# EAGLE design BatchE (EAGLE 6.4)

## Sheet 1 of 3
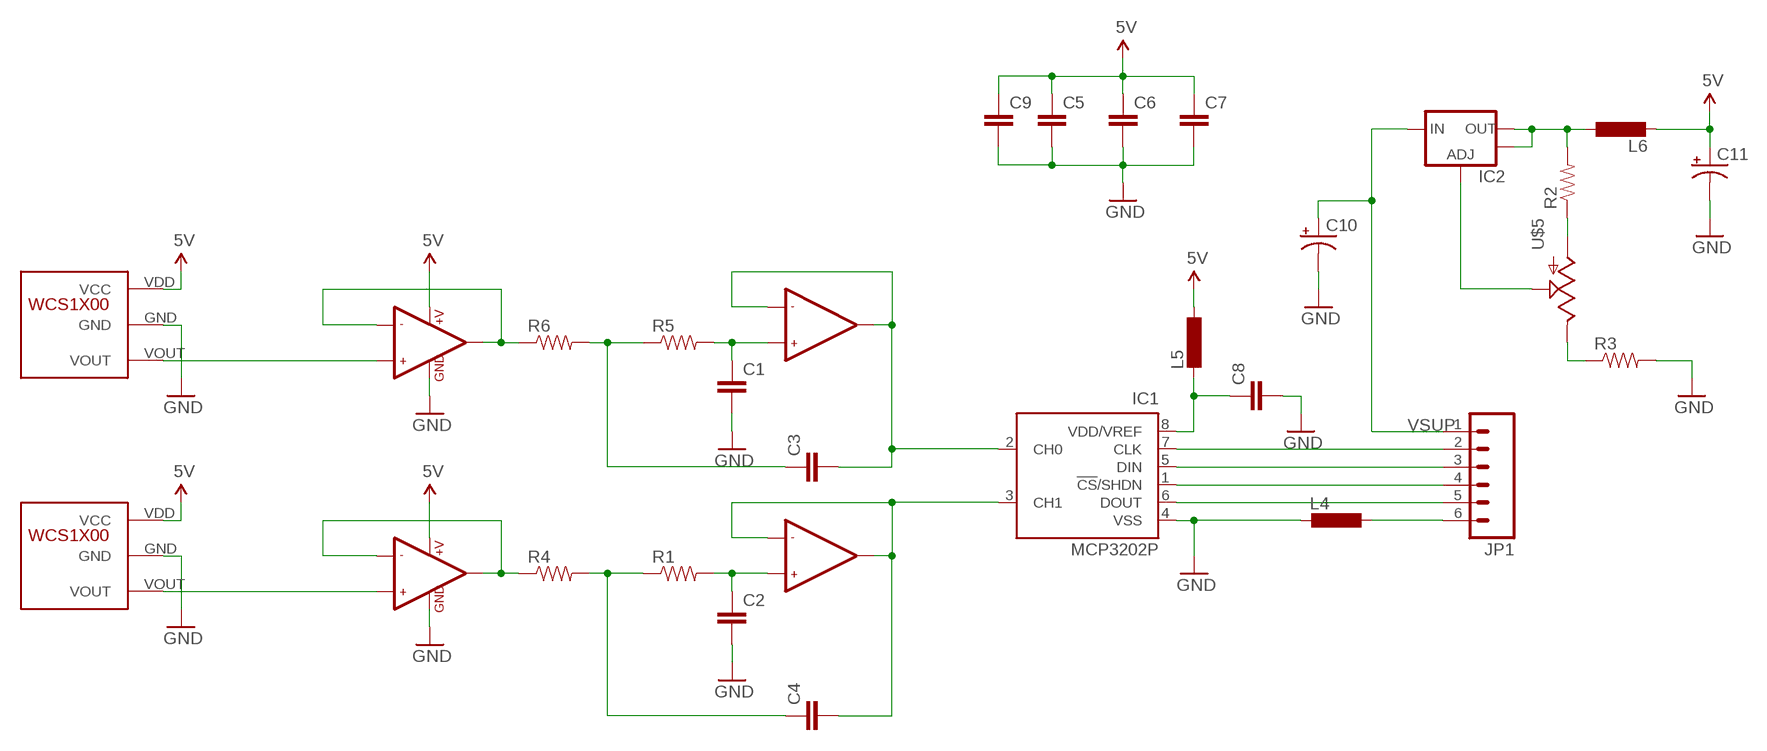
[diagram p0: schematic, sheet 1]

### Parts
C1  CAP1206  [1206]
C2  CAP1206  [1206]
C3  CAP1206  [1206]
C4  CAP1206  [1206]
C5  CAP1206  [1206]
C6  CAP1206  [1206]
C7  CAP1206  [1206]
C8  CAP1206  [1206]
C9  CAP1206  [1206]
C10  CAP_POLPTH4  [CPOL-RADIAL-1000UF-25V]
C11  CAP_POLPTH1  [CPOL-RADIAL-100UF-25V]
IC1  MCP3202P  [DIL8]
IC2  V_REG_LM1117SOT223  [SOT223]
JP1  M06LONGPADS  [1X06_LONGPADS]
L4  L-EU0204V  [0204V]
L5  L-EU0204V  [0204V]
L6  L-EU0204V  [0204V]
R1  RESISTOR1206  [1206]
R2  RESISTOR1206  [1206]
R3  RESISTOR1206  [1206]
R4  RESISTOR1206  [1206]
R5  RESISTOR1206  [1206]
R6  RESISTOR1206  [1206]
U$1  LMV358  [SO08]
U$2  LMV358  [SO08]
U$3  WCS1X00  [WCS1X00]
U$4  WCS1X00  [WCS1X00]
U$5  POTTRIM  [TRIM_POT]

### Nets
5V: C5.1 C6.1 C7.1 C9.1 C11.1(+) L5.1 L6.2 U$1.8(+V) U$2.8(+V) U$3.VDD(VCC) U$4.VDD(VCC)
GND: C1.2 C2.2 C5.2 C6.2 C7.2 C8.2 C9.2 C10.2(-) C11.2(-) IC1.4(VSS) L4.2 R3.2 U$1.4(GND) U$2.4(GND) U$3.GND U$4.GND ; also sheet 3
N$1: R6.1 U$1.1(OUT1) U$1.2(-IN1)
N$2: R4.1 U$2.1(OUT1) U$2.2(-IN1)
N$3: C3.1 R5.1 R6.2
N$4: C1.1 R5.2 U$1.5(+IN2)
N$5: C3.2 IC1.2(CH0) U$1.6(-IN2) U$1.7(OUT2)
N$6: U$1.3(+IN1) U$3.VOUT
N$7: C4.2 IC1.3(CH1) U$2.6(-IN2) U$2.7(OUT2)
N$8: C2.1 R1.2 U$2.5(+IN2)
N$9: C4.1 R1.1 R4.2
N$10: U$2.3(+IN1) U$4.VOUT
N$11: R2.1 U$5.3(A)
N$12: IC2.1(ADJ) U$5.1(S)
N$13: IC1.7(CLK) JP1.2
N$14: IC1.5(DIN) JP1.3
N$15: IC1.1(!CS!/SHDN) JP1.4
N$16: IC1.6(DOUT) JP1.5
N$17: IC2.2(OUT) IC2.4(OUT) L6.1 R2.2
N$18: R3.1 U$5.2(E)
N$19: JP1.6 L4.1
N$20: C8.1 IC1.8(VDD/VREF) L5.2
VSUP: C10.1(+) IC2.3(IN) JP1.1

## Sheet 2 of 3
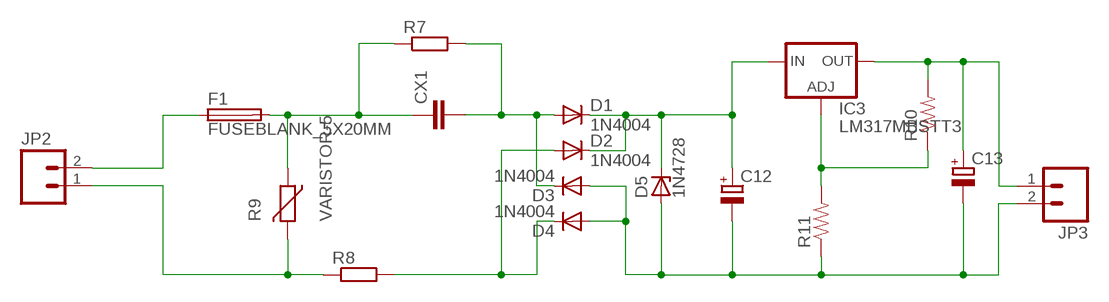
[diagram p1: schematic, sheet 2]

### Parts
C12  CPOL-EUE5-8.5  [E5-8,5]
C13  CPOL-EUE5-8.5  [E5-8,5]
CX1  CXXC15B8  [XC15B8]
D1  1N4004  [DO41-10]
D2  1N4004  [DO41-10]
D3  1N4004  [DO41-10]
D4  1N4004  [DO41-10]
D5  1N4728  [DO41Z10]
F1  FUSEBLANK_5X20MM  [FUSE_HOLDER_5X20MM]
IC3  LM317MBSTT3  [SOT223]
JP2  M023.5MM  [SCREWTERMINAL-3.5MM-2]
JP3  M023.5MM  [SCREWTERMINAL-3.5MM-2]
R7  R-EU_0207/12  [0207/12]
R8  R-EU_0207/12  [0207/12]
R9  VARISTOR-5  [R-5]
R10  RESISTOR0805-RES  [0805]
R11  RESISTOR0805-RES  [0805]

### Nets
N$21: F1.1 JP2.2
N$22: CX1.1 F1.2 R7.1 R9.1
N$23: CX1.2 D1.A D3.C R7.2
N$24: D2.A D4.C R8.2
N$25: JP2.1 R8.1 R9.2
N$26: C12.+ D1.C D2.C D5.C IC3.3(IN)
N$27: IC3.1(ADJ) R10.1 R11.2
N$28: C12.- C13.- D3.A D4.A D5.A JP3.2 R11.1
N$30: C13.+ IC3.4(OUT) JP3.1 R10.2

## Sheet 3 of 3
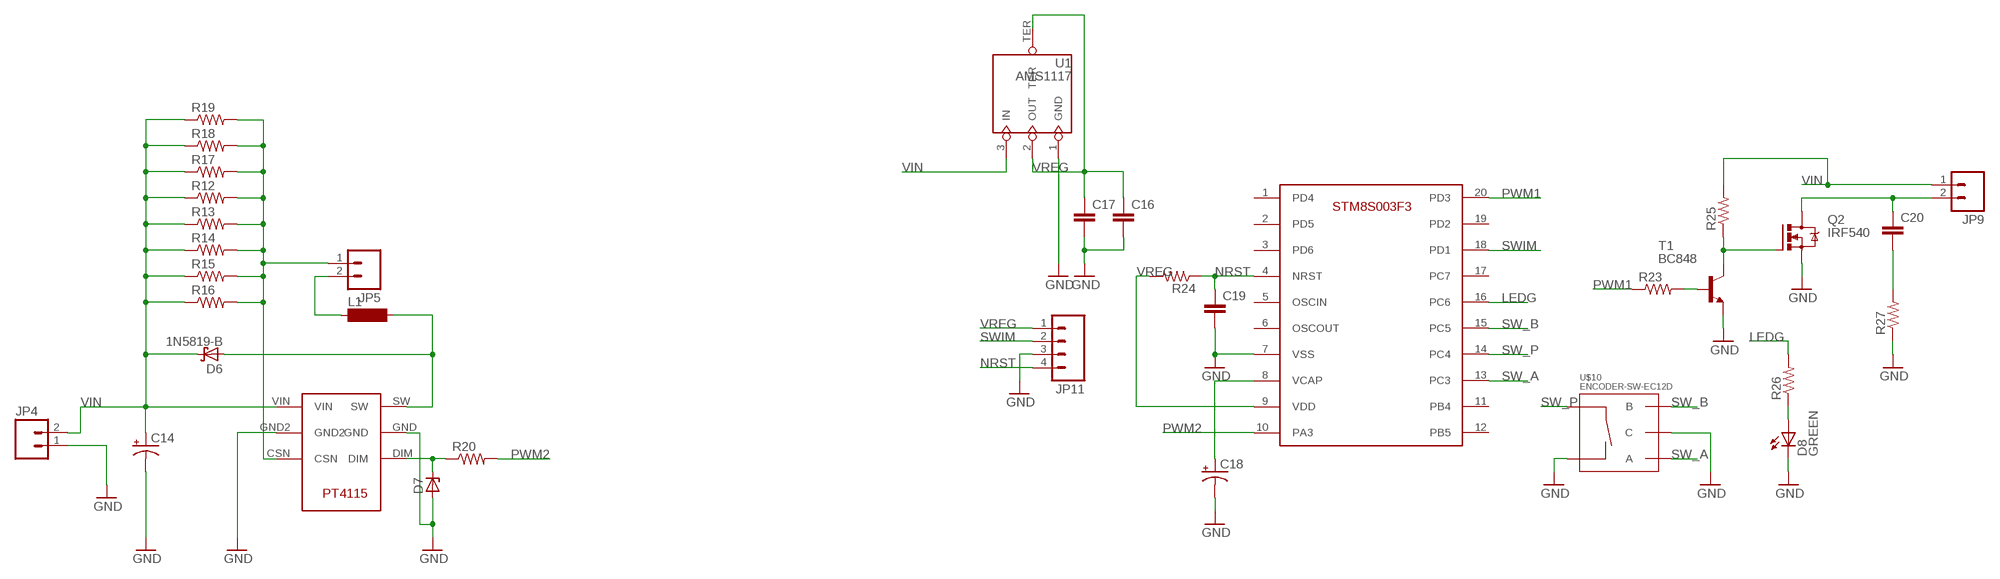
[diagram p2: schematic, sheet 3]

### Parts
C14  CAP_POLPTH4  [CPOL-RADIAL-1000UF-25V]
C16  CAP1206  [1206]
C17  CAP1206  [1206]
C18  CAP_POLPTH2  [CPOL-RADIAL-10UF-25V]
C19  CAP1206  [1206]
C20  CAP1206  [1206]
D6  1N5819-B  [DO41-7.6]
D7  ZENER-DIODEZD-7.5  [ZDIO-7.5]
D8  GREEN  LED-GREENLARGE  [LED-1206]
JP4  M02LOCK_LONGPADS  [1X02_LOCK_LONGPADS]
JP5  M02LOCK_LONGPADS  [1X02_LOCK_LONGPADS]
JP9  M02LOCK_LONGPADS  [1X02_LOCK_LONGPADS]
JP11  M04PTH  [1X04]
L1  BS11  [BS11]
Q2  IRF540  [TO220BV]
R12  RESISTOR1206  [1206]
R13  RESISTOR1206  [1206]
R14  RESISTOR1206  [1206]
R15  RESISTOR1206  [1206]
R16  RESISTOR1206  [1206]
R17  RESISTOR1206  [1206]
R18  RESISTOR1206  [1206]
R19  RESISTOR1206  [1206]
R20  RESISTOR1206  [1206]
R23  RESISTOR0805-RES  [0805]
R24  RESISTOR0805-RES  [0805]
R25  RESISTOR0805-RES  [0805]
R26  RESISTOR0805-RES  [0805]
R27  RESISTOR0805-RES  [0805]
T1  BC848  [SOT23]
U1  AMS1117  [SOT-223]
U$6  PT4115  [PT4115]
U$9  STM8S003F3  [SSOP20]
U$10  ENCODER-SW-EC12D  [ENCODER-SW-EC12D]

### Nets
GND: C14.2(-) C16.2 C17.2 C18.2(-) C19.2 D7.A D8.C JP4.1 JP11.3 Q2.S R27.1 T1.2(E) U1.1(GND) U$6.GND U$6.GND2 U$9.7(VSS) U$10.4(C) U$10.5(SW-) ; also sheet 1
LEDG: R26.2 U$9.16(PC6)
N$29: JP5.1 R12.2 R13.2 R14.2 R15.2 R16.2 R17.2 R18.2 R19.2 U$6.CSN
N$31: D8.A R26.1
N$33: Q2.G R25.1 T1.3(C)
N$35: D7.C R20.1 U$6.DIM
N$36: C20.2 R27.2
N$37: D6.A L1.2 U$6.SW
N$38: JP5.2 L1.1
N$42: C20.1 JP9.2 Q2.D
N$43: C18.1(+) U$9.8(VCAP)
N$44: R23.2 T1.1(B)
NRST: C19.1 JP11.4 R24.1 U$9.4(NRST)
PWM1: R23.1 U$9.20(PD3)
PWM2: R20.2 U$9.10(PA3)
SW_A: U$9.13(PC3) U$10.1(A)
SW_B: U$9.15(PC5) U$10.3(B)
SW_P: U$9.14(PC4) U$10.2(SW+)
SWIM: JP11.2 U$9.18(PD1)
VIN: C14.1(+) D6.C JP4.2 JP9.1 R12.1 R13.1 R14.1 R15.1 R16.1 R17.1 R18.1 R19.1 R25.2 U1.3(IN) U$6.VIN
VREG: C16.1 C17.1 JP11.1 R24.2 U1.2(OUT) U1.TER U$9.9(VDD)
Unconnected: U$9.1(PD4) U$9.2(PD5) U$9.3(PD6) U$9.5(OSCIN) U$9.6(OSCOUT) U$9.11(PB4) U$9.12(PB5) U$9.17(PC7) U$9.19(PD2)

## Library data of the parts
C1-C9 C16 C17 C19 C20 = SparkFun-Capacitors:CAP: Capacitor Standard 0603 ceramic capacitor, and 0.1" leaded capacitor.
C10 C11 C14 C18 = SparkFun-Capacitors:CAP_POL: Capacitor Polarized These are standard SMD and PTH capacitors. Normally 10uF, 47uF, and 100uF in electrolytic and tantalum varieties. Always verify the external diameter of the through hole cap, it varies with capacity, voltage, and manufacturer. The EIA devices should be standard.
C12 C13 = rcl:CPOL-EU: POLARIZED CAPACITOR, European symbol
CX1 = resistor:CX: X CAPACITOR for power line
D1-D4 = diode:1N4004: DIODE general purpose rectifier, 1 A
D5 = diode:1N4728: Z DIODE 3.3 V, 1W, 5 percent
D6 = diode:1N581*: 1.0A SCHOTTKY BARRIER RECTIFIER Source: http://www.diodes.com/datasheets/ds23001.pdf
D7 = diode:ZENER-DIODE: Z-Diode
D8 = SparkFun-LED:LED-GREEN: Various green LEDs 0603- DIO-00821 LARGE- DIO-00862 LILYPAD- DIO-09910; PROD_ID: DIO-00862
F1 = fuse:FUSE: Fuse; OC_FARNELL: unknown; OC_NEWARK: unknown
IC1 = microchip:MCP3202: 2.7V Dual Channel 12-Bit A/D Converter with SPI Serial Interface Source: http://ww1.microchip.com/downloads/en/DeviceDoc/21034D.pdf; MF: MICROCHIP; MPN: MCP3202-CI/P; OC_FARNELL: 1196794; OC_NEWARK: 72K7287
IC2 = SparkFun-PowerIC:V_REG_LM1117: Voltage Regulator LM1117 Standard adjustable voltage regulator but in SMD form. Spark Fun Electronics SKU : COM-00595
IC3 = v-reg:LM317?*: 500 mA Adjustable Output Positive Voltage Regulator Source: http://www.onsemi.co.jp .. LM317M-D.PDF
JP1 = SparkFun-Connectors:M06: Header 6 Standard 6-pin 0.1" header. Use with straight break away headers (SKU : PRT-00116), right angle break away headers (PRT-00553), swiss pins (PRT-00743), machine pins (PRT-00117), and female headers (PRT-00115). Molex polarized connector foot print use with SKU : PRT-08094 with associated crimp pins and housings. NOTES ON THE VARIANTS LOCK and LOCK_LONGPADS... This footprint was designed to help hold the alignment of a through-hole component (i.e. 6-pin header) while soldering it into place. You may notice that each hole has been shifted either up or down by 0.005 of an inch from it's more standard position (which is a perfectly straight line). This slight alteration caused the pins (the squares in the middle) to touch the edges of the holes. Because they are alternating, it causes a "brace" to hold the component in place. 0.005 has proven to be the perfect amount of "off-center" position when using our standard breakaway headers. Although looks a little odd when you look at the bare footprint, once you have a header in there, the alteration is very hard to notice. Also, if you push a header all the way into place, it is covered up entirely on the bottom side. This idea of altering the position of holes to aid alignment will be further integrated into the Sparkfun Library for other footprints. It can help hold any component with 3 or more connection pins.
JP2-JP5 JP9 = SparkFun-Connectors:M02: Header 2 Standard 2-pin 0.1" header. Use with straight break away headers (SKU : PRT-00116), right angle break away headers (PRT-00553), swiss pins (PRT-00743), machine pins (PRT-00117), and female headers (PRT-00115). Molex polarized connector foot print use with SKU : PRT-08233 with associated crimp pins and housings.
JP11 = SparkFun-Connectors:M04: Header 4 Standard 4-pin 0.1" header. Use with straight break away headers (SKU : PRT-00116), right angle break away headers (PRT-00553), swiss pins (PRT-00743), machine pins (PRT-00117), and female headers (PRT-00115). Molex polarized connector foot print use with SKU : PRT-08231 with associated crimp pins and housings. 1MM SMD Version SKU: PRT-10208
L1 = inductor-neosid:BS: INDUCTOR nominal inductance, magnetically screened; OC_FARNELL: unknown; OC_NEWARK: unknown
L4-L6 = rcl:L-EU: INDUCTOR, European symbol
Q2 = transistor-power:IRF540: HEXFET Power MOSFET
R1-R6 R23-R27 = SparkFun-Passives:RESISTOR: Resistor Basic schematic elements and footprints for 0603, 1206, and PTH resistors.
R7 R8 = rcl:R-EU_: RESISTOR, European symbol
R9 = varistor:VARISTOR: VARISTOR
R10-R20 = SparkFun-Resistors:RESISTOR: Resistor Basic schematic elements and footprints for 0603, 1206, and PTH resistors.
T1 = transistor-neu-to92:BC848: NPN TRANSISTOR
U1 = IC:AMS1117
U$1 U$2 = SparkFun-AnalogIC:LMV358: Jellybean rail-to-rail output op-amp
U$3 U$4 = IC:WCS1X00
U$5 = SparkFun-Electromechanical:POT
U$6 = IC:PT4115
U$9 = SparkFun-DigitalIC:STM8S003F3
U$10 = SparkFun-Electromechanical:ENCODER-SW-EC12D

## Board
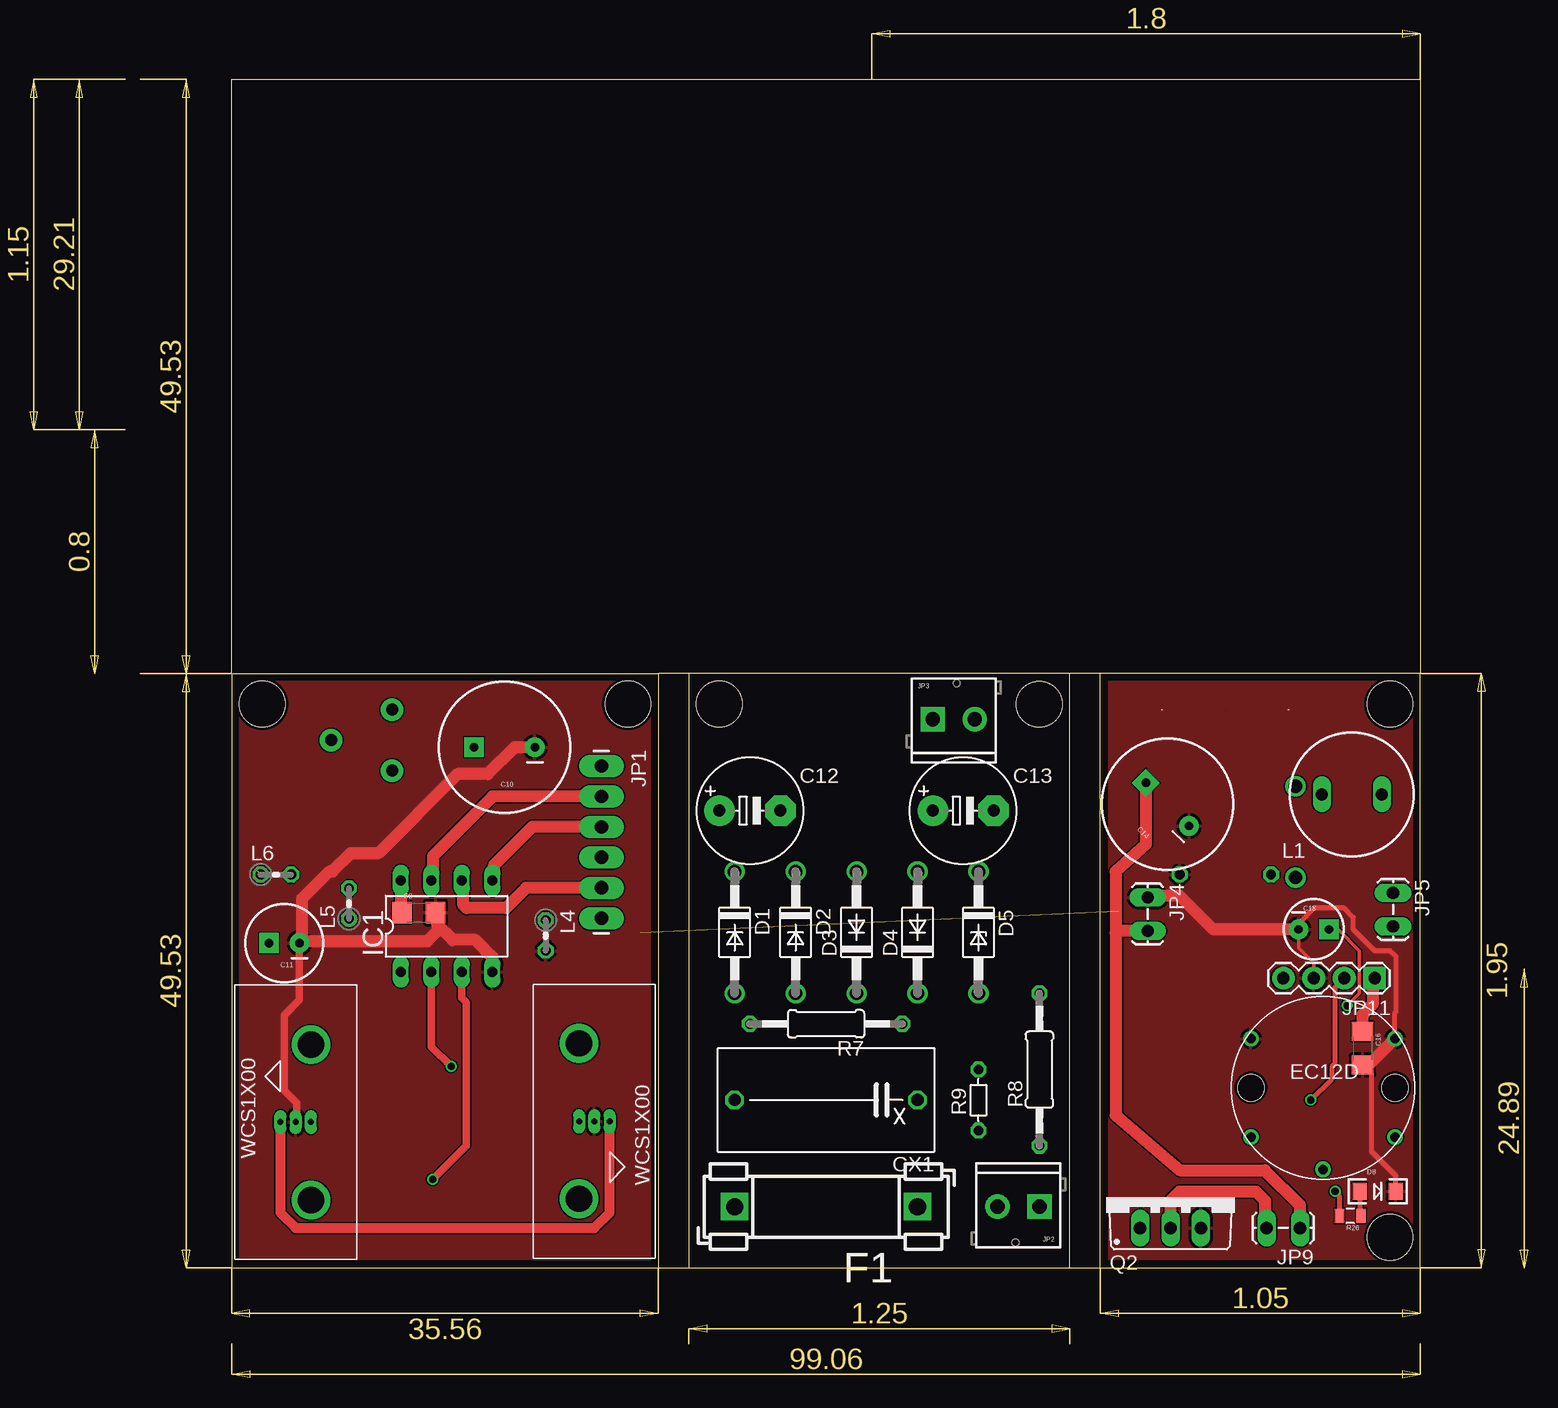
[diagram p3: board, top side]
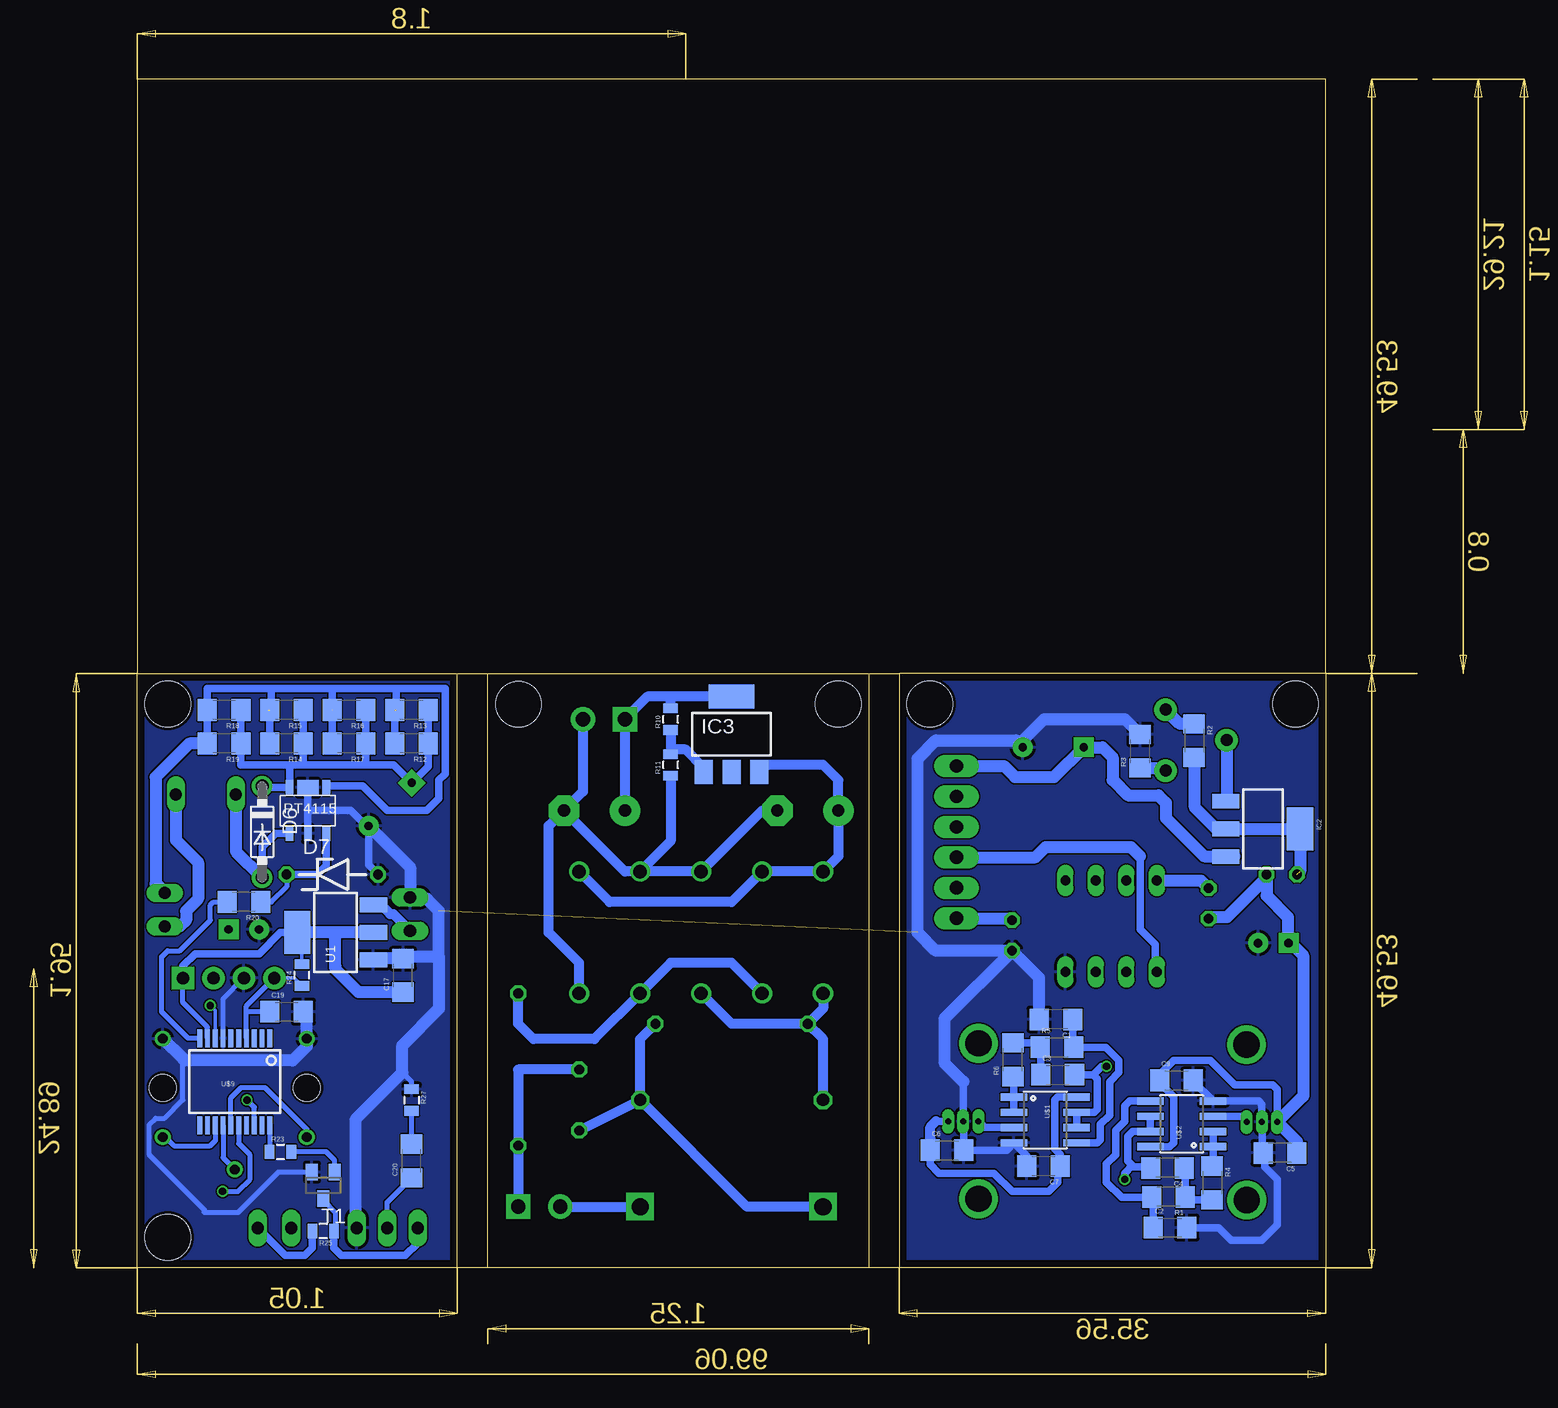
[diagram p4: board, bottom side, seen from below]

Size 99.06 x 99.06 mm. Coordinates in mm from the lower left corner, seen from the top.
Outline: 35.56,0 0,0 0,49.53
Outline: 35.56,0 38.1,0
Outline: 38.1,0 69.85,0
Outline: 69.85,0 72.39,0
Outline: 72.39,0 99.06,0 99.06,49.53
Outline: 99.06,49.53 72.39,49.53
Outline: 72.39,49.53 69.85,49.53
Outline: 69.85,49.53 38.1,49.53
Outline: 38.1,49.53 35.56,49.53
Outline: 35.56,49.53 35.56,0
Outline: 38.1,49.53 38.1,0
Outline: 0,49.53 35.56,49.53
Outline: 69.85,0 69.85,49.53
Outline: 72.39,0 72.39,49.53
Outline: 0,49.53 0,69.85 0,99.06 53.34,99.06 99.06,99.06 99.06,49.53
Copper layers (1*16): Top 0.035mm / dielectric 1.5mm / Bottom 0.035mm
Design rules "dirt_cheap_dirty_boards.v1": minimum track width 5mil, minimum drill 12mil, track to track 5mil, track to pad 5mil, pad to pad 5mil, via to via 5mil, smd to smd 0mil, copper to edge 10mil, drill to drill 10mil, minimum pad ring 10mil, minimum via ring 6mil, stop-mask expansion 2mil, vias tented up to drill 25mil, thermal gap 10mil
Holes 3.81 mm at 2.54,46.99 33.02,46.99 40.64,46.99 67.28,46.96 96.52,2.54 96.52,46.99

### Footprints (pad centres in the part's own frame; a part is rotated, then mirrored left to right if it is on the bottom)
1206 = smd 1.6 x 1.8: 1 -1.4,0; 2 1.4,0
CPOL-RADIAL-1000UF-25V = drill 0.7 pad 1.651 square: 1 2.54,0 | drill 0.7 pad 1.651: 2 -2.54,0
CPOL-RADIAL-100UF-25V = drill 0.7 pad 1.651 square: 1 1.27,0 | drill 0.7 pad 1.651: 2 -1.27,0
E5-8,5 = drill 1.016 pad 2.54: + -2.54,0 | drill 1.016 pad 2.54 octagon: - 2.54,0
CPOL-RADIAL-10UF-25V = drill 0.7 pad 1.651 square: 1 1.27,0 | drill 0.7 pad 1.651: 2 -1.27,0
XC15B8 = drill 1.016 octagon: 1 -7.62,0; 2 7.62,0
DO41-10 = drill 1.118: A 5.08,0; C -5.08,0
DO41Z10 = drill 1.118: A 5.08,0; C -5.08,0
DO41-7.6 = drill 1.1 pad 1.7: A 3.81,0; C -3.81,0
ZDIO-7.5 = drill 0.813 octagon: A 3.81,0; C -3.81,0
LED-1206 = smd 1.2 x 1.4: A -1.5,0; C 1.5,0
FUSE_HOLDER_5X20MM = drill 1.422 pad 2.286 square: 1 0,0; 2 15.24,0
DIL8 = drill 0.813 long: 1 -3.81,-3.81; 2 -1.27,-3.81; 3 1.27,-3.81; 4 3.81,-3.81; 5 3.81,3.81; 6 1.27,3.81; 7 -1.27,3.81; 8 -3.81,3.81
SOT223 = smd 1.219 x 2.235: 1 -2.311,-3.099; 2 0,-3.099; 3 2.311,-3.099 | smd 3.6 x 2.2: 4 0,3.099
SOT223' = smd 1.5 x 2: 1 -2.3,-3.15; 2 0,-3.15; 3 2.3,-3.15 | smd 3.8 x 2: 4 0,3.15
1X06_LONGPADS = drill 1.118 pad 1.88 long: 1 0,0; 2 2.54,0; 3 5.08,0; 4 7.62,0; 5 10.16,0; 6 12.7,0
SCREWTERMINAL-3.5MM-2 = drill 1.2 pad 2.032 square: 1 0,0 | drill 1.2 pad 2.032: 2 3.5,0
1X02_LOCK_LONGPADS = drill 1.016 long: 1 -0.127,0; 2 2.667,0
1X04 = drill 1.016 pad 1.88 square: 1 0,0 | drill 1.016 pad 1.88: 2 2.54,0; 3 5.08,0; 4 7.62,0
BS11 = drill 1 long: 1 -2.5,0; 2 2.5,0
0204V = drill 0.813 octagon: 1 -1.27,0; 2 1.27,0
TO220BV = drill 1.016 long: D 0,-2.54; G -2.54,-2.54; S 2.54,-2.54
0207/12 = drill 0.813 octagon: 1 -6.35,0; 2 6.35,0
R-5 = drill 0.813 octagon: 1 -2.54,0; 2 2.54,0
0805 = smd 0.8 x 1.2: 1 -0.9,0; 2 0.9,0
SOT23 = smd 1 x 1.4: 1 -0.95,-1.1; 2 0.95,-1.1; 3 0,1.1
SOT-223 = smd 1.27 x 2.286: 1 -2.286,-3.175; 2 0,-3.175; 3 2.286,-3.175 | smd 3.556 x 2.159: TER 0,3.175
SO08 = smd 0.61 x 2.21: 1 -1.905,-2.616; 2 -0.635,-2.616; 3 0.635,-2.616; 4 1.905,-2.616; 5 1.905,2.616; 6 0.635,2.616; 7 -0.635,2.616; 8 -1.905,2.616
WCS1X00 = drill 0.5 pad 0.813 long: GND 0,0; VDD -1.27,0; VOUT 1.27,0 | drill 2.2: P$4 1.285,6.46; P$5 1.27,-6.5
TRIM_POT = drill 1 pad 1.88: 1 5.08,0; 2 0,2.54; 3 0,-2.54
PT4115 = smd 0.635 x 1.27: CSN 1.524,1.905; DIM 1.524,-1.905; GND 0,-1.905; SW -1.524,-1.905; VIN -1.524,1.905 | smd 1.778 x 1.27: GND2 0,1.905
SSOP20 = smd 0.4 x 1.5: 1 -2.925,-3.625; 2 -2.275,-3.625; 3 -1.625,-3.625; 4 -0.975,-3.625; 5 -0.325,-3.625; 6 0.325,-3.625; 7 0.975,-3.625; 8 1.625,-3.625; 9 2.275,-3.625; 10 2.925,-3.625; 11 2.925,3.625; 12 2.275,3.625; 13 1.625,3.625; 14 0.975,3.625; 15 0.325,3.625; 16 -0.325,3.625; 17 -0.975,3.625; 18 -1.625,3.625; 19 -2.275,3.625; 20 -2.925,3.625
ENCODER-SW-EC12D = drill 0.8: 1 -6,4.1; 2 0,6.8; 3 6,4.1; 4 -6,-4.1; 5 6,-4.1 | hole 2.2: -6,0; 6,0

### Placement (x,y rotation side)
C1  22.5,20.68 180 bottom
C2  12.99,3.34 0 bottom
C3  22.36,16.08 0 bottom
C4  13.2,8.31 180 bottom
C5  3.83,9.55 180 bottom
C6  31.57,9.79 0 bottom
C7  23.53,8.45 180 bottom
C8  15.59,29.6 0 top
C9  12.46,15.61 0 bottom
C10  22.73,43.38 180 top
C11  4.38,27.06 180 top
C12  43.18,38.1 0 top
C13  60.96,38.1 0 top
C14  77.98,38.61 135 top
C16  94.23,18.29 270 top
C17  76.91,24.36 90 bottom
C18  90.17,28.19 0 top
C19  86.61,21.34 0 bottom
C20  76.2,8.89 90 bottom
CX1  49.53,13.97 180 top
D1  41.91,27.94 270 top
D2  46.99,27.94 270 top
D3  52.07,27.94 90 top
D4  57.15,27.94 90 top
D5  62.23,27.94 270 top
D6  88.65,36.32 270 bottom
D7  82.8,32.77 0 bottom
D8  95.5,6.35 0 top
F1  57.15,5.08 180 top
IC1  17.9,28.46 0 top
IC2  5.25,36.57 270 bottom
IC3  LM317MBSTT3  [SOT223']  49.53,44.45 0 bottom
JP1  30.8,41.81 270 top
JP2  67.31,5.08 180 top
JP3  58.42,45.72 0 top
JP4  76.33,30.73 270 top
JP5  96.77,31.11 270 top
JP9  88.9,3.3 180 top
JP11  95.25,24.13 180 top
L1  93.34,39.45 180 top
L4  26.16,27.69 270 top
L5  9.78,30.35 90 top
L6  3.68,32.77 0 top
Q2  78.23,5.84 0 top
R1  13.12,5.89 180 bottom
R2  10.98,43.92 270 bottom
R3  15.49,43.05 90 bottom
R4  9.49,7.06 270 bottom
R5  22.42,18.36 0 bottom
R6  26.09,17.32 90 bottom
R7  49.53,20.32 180 top
R8  67.31,16.51 90 top
R9  62.23,13.97 90 top
R10  54.61,45.72 90 bottom
R11  54.61,41.91 90 bottom
R12  76.2,43.69 180 bottom
R13  76.2,46.48 180 bottom
R14  86.61,43.69 180 bottom
R15  86.61,46.48 180 bottom
R16  81.41,46.48 180 bottom
R17  81.41,43.69 180 bottom
R18  91.82,46.48 180 bottom
R19  91.82,43.69 180 bottom
R20  90.17,30.48 180 bottom
R23  87.12,9.65 0 bottom
R24  85.34,24.38 90 bottom
R25  83.57,3.05 180 bottom
R26  93.22,4.32 180 top
R27  76.2,13.97 270 bottom
T1  83.57,6.86 180 bottom
U1  82.55,27.94 90 bottom
U$1  23.39,12.31 270 bottom
U$2  12.02,11.98 90 bottom
U$3  30.23,12.19 180 top
U$4  5.33,12.14 0 top
U$5  13.37,43.97 180 top
U$6  84.84,38.1 0 bottom
U$9  90.93,15.49 180 bottom
U$10  90.93,14.99 180 top

### Tracks (layer width: path | path; a pad name or v marks a point on that pad's centre or on a via)
5V
  Top 0.813: U$4.VDD 4.06,4.57 5.33,3.3 30.23,3.3 31.5,4.57 U$3.VDD
  Bottom 0.61: 32.97,10.75 C6.1 32.97,8.59 32.26,7.87 27.69,7.87 26.16,6.35 23.11,6.35 22.35,7.11 22.35,8.23 C7.1 22.13,9.43 22.61,9.91 22.61,13.97 22.35,14.22 20.78,14.22 U$1.8 | U$2.8 13.04,10.07 12.7,10.41 12.7,14.22 13.86,15.38 C9.1 13.86,16.12 12.7,17.27 9.65,17.27 7.62,15.24 4.45,15.24 4.06,14.86 U$4.VDD | 32.51,12.19 U$3.VDD
  Bottom 0.813: 32.97,10.75 32.97,11.73 32.51,12.19
  Bottom 1.016: L5.1 9.65,29.21 8.26,29.21 4.95,32.51 L6.2 4.95,30.99 3.17,29.21 3.17,27.13 C11.1 2.93,27.06 1.91,26.04 1.91,14.25 1.96,14.25 U$4.VDD 2.43,10.51 C5.1
GND  (1 unrouted)
  Top 0.305: JP11.3 90.17,25.4 88.9,26.67 C18.2
  Top 0.406: U$10.4 96.93,21.24 97.03,21.34 97.03,25.91 96.52,26.42 95.25,26.42 93.47,28.19 93.47,29.21 92.71,29.97 90.17,29.97 88.9,28.7 C18.2 | D8.C 97,7.64 95,9.65 95,16.13 C16.2
  Top 0.61: C11.2 5.65,22.31 4.37,21.03 4.37,14.78 5.44,13.72 5.44,12.24 U$4.GND
  Top 1.016: IC1.4 21.71,25.91 20.32,27.3 18.41,27.3 17.14,28.57 | 17.14,28.57 17.14,29.44 C8.2 | C10.2 23.57,43.38 21.34,41.15 18.8,41.15 12.19,34.54 9.91,34.54 8.38,33.02 8.13,33.02 5.84,30.73 5.84,27.25 C11.2 5.77,27.18 16.26,27.18 17.14,28.07 17.14,28.57 | C16.2 94.73,16.89 U$10.4 | C18.2 81.79,28.19 78.99,30.99 76.45,30.99 JP4.1
  Bottom 0.406: U$9.7 91.91,22.39 JP11.3 | 80.84,3.37 Q2.S | T1.2 87.29,7.96 90.68,4.57 93.47,4.57 93.47,4.83 98.04,9.4 98.04,11.94 97.54,12.45 96.77,12.45 95.25,13.97 95.25,17.27 95.18,17.34 | R27.1 76.2,15.49 76.96,16.26
  Bottom 0.61: C9.2 11.05,15.54 U$2.4 5.6,13.88 5.33,13.61 U$4.GND 5.31,12.12 5.31,9.63 | C2.2 8.92,3.34 7.87,2.29 5.33,2.29 4.06,3.56 4.06,7.37 5.08,8.38 5.08,9.4 C5.2 | C7.2 24.93,9.33 U$1.4 26.62,9.79 C6.2 30.17,12.14 U$3.GND 30.22,12.2 30.22,15.48 | U$6.GND2 84.84,38.1 | 84.84,38.1 U$6.GND | 84.84,38.1 81.28,38.1 79.99,36.81 C14.2 79.77,33.55 D7.A
  Bottom 0.813: 30.22,15.48 30.18,15.48
  Bottom 1.016: R3.2 16.76,45.72 23.5,45.72 25.27,43.95 C10.2 25.83,43.94 32.51,43.94 34.04,42.42 34.04,27.94 32.51,26.42 L4.2 | 30.22,15.48 31.75,17.02 31.75,20.83 L4.2 | C1.2 23.9,24.15 L4.2 | 5.33,9.66 5.31,9.63 C5.2 | U1.1 79.27,25.76 C17.2 76.76,25.91 73.91,25.91 | C14.2 76.33,33.37 JP4.1 76.2,30.73 74.93,30.73 73.91,29.72 73.91,25.91 | 73.91,25.91 73.91,21.59 76.96,18.54 76.96,16.26 80.84,12.38 80.84,3.37 | C19.2 84.93,21.05 U$10.5 84.93,18.45 86.11,17.27 95.12,17.27 95.18,17.34 U$10.4
  pour Bottom: 0.64,48.9 34.92,48.9 34.92,0.64 0.64,0.64
  pour Top: 0.64,48.9 34.92,48.9 34.92,0.64 0.64,0.64
  pour Top: 73.03,48.9 96.52,48.9 98.42,46.99 98.42,0.64 73.03,0.64
  pour Bottom: 73.03,48.9 96.52,48.9 98.42,46.99 98.42,0.64 73.03,0.64
LEDG  (via drill 0.6)
  Top 0.406: R26.2 92.32,5.98 v91.95,6.35
  Bottom 0.406: v91.95,6.35 90.68,6.35 89.66,7.37 89.66,9.4 90.61,10.34 U$9.16
N$1
  Bottom 0.61: U$1.2 U$1.1 26,15.84 R6.1
N$2
  Bottom 0.61: U$2.2 U$2.1 9.4,8.54 R4.1
N$3
  Bottom 0.61: C3.1 23.76,18.3 R5.1 24.18,18.72 R6.2
N$4
  Bottom 0.61: C1.1 21.1,18.44 R5.2 18.36,18.36 17.27,17.27 17.27,16.26 18.03,15.49 18.03,12.7 18.8,11.94 18.8,10.67 19.05,10.41 20.76,10.41 U$1.5
N$5  (via drill 0.6)
  Top 0.61: IC1.2 16.63,18.42 v18.29,16.76
  Bottom 0.61: U$1.6 U$1.7 20.76,12.95 19.3,12.95 19.05,13.21 19.05,15.75 19.38,16.08 | C3.2 19.38,16.08 | v18.29,16.76 18.69,16.76 19.38,16.08
N$6
  Bottom 0.61: U$1.3 28.43,11.67 U$3.VOUT
N$7  (via drill 0.6)
  Top 0.61: IC1.3 19.17,22.48 19.56,22.1 19.56,10.16 v16.76,7.37
  Bottom 0.61: U$2.6 U$2.7 16.09,11.34 16.51,10.92 16.51,8.89 16.13,8.51 | 16.13,8.51 16,8.38 14.67,8.38 C4.2 | v16.76,7.37 16.76,7.87 16.13,8.51
N$8
  Bottom 0.61: C2.1 14.39,5.77 R1.2 14.57,5.84 17.02,5.84 18.29,7.11 18.29,8.64 17.53,9.4 17.53,11.43 16.76,12.19 16.76,13.46 16.34,13.88 U$2.5
N$9
  Bottom 0.61: C4.1 11.72,8.23 R1.1 11.48,5.66 R4.2
N$10
  Bottom 0.61: U$2.3 7.08,12.61 U$4.VOUT
N$11
  Bottom 1.016: R2.1 12.17,45.32 U$5.3
N$12
  Bottom 1.016: U$5.1 8.29,38.95 IC2.1
N$13
  Top 1.016: JP1.2 21.75,39.27 16.76,34.29 16.76,32.4 IC1.7
N$14
  Top 1.016: JP1.3 25.05,36.73 21.84,33.53 21.84,32.4 IC1.5
N$15
  Bottom 0.61: 15.49,34.29 15.49,28.19 14.22,26.92 14.22,24.78 IC1.1
  Bottom 1.016: JP1.4 24.23,34.2 23.37,35.05 16.26,35.05 15.49,34.29
N$16
  Top 1.016: JP1.5 24.54,31.66 22.86,29.97 19.56,29.97 19.3,30.23 19.3,32.14 IC1.6
N$17  (1 unrouted)
  Bottom 1.016: 2.16,33.02 IC2.4 IC2.2 9.14,36.57 10.92,38.35 10.92,42.46 R2.2
N$18
  Bottom 1.016: R3.1 13.58,41.65 U$5.2
N$19
  Bottom 1.016: JP1.6 26.32,29.11 L4.1
N$20
  Top 1.016: IC1.8 14.09,29.69 C8.1
  Bottom 1.016: IC1.8 10.43,32.27 L5.2
N$21
  Bottom 0.813: JP2.2 F1.1
N$22
  Bottom 0.813: F1.2 48.26,5.08 CX1.1 | CX1.1 57.15,19.05 R7.1 | R9.1 CX1.1
N$23
  Bottom 0.813: CX1.2 41.91,19.05 R7.2 | D1.A 41.91,21.59 R7.2 | R7.2 49.53,20.32 D3.C
N$24
  Bottom 0.813: D2.A 49.53,25.4 54.61,25.4 D4.C 60.96,19.05 66.04,19.05 67.31,20.32 R8.2
N$25
  Bottom 0.813: R9.2 67.31,16.51 R8.1 JP2.1
N$26
  Bottom 0.813: IC3.3 46.62,41.91 41.91,41.91 40.64,40.64 C12.+ 40.64,34.29 D1.C D2.C 49.53,30.48 59.69,30.48 D5.C
N$27
  Bottom 0.813: IC3.1 51.83,41.67 53.34,43.18 54.24,43.18 R11.2 R10.1
N$28
  Bottom 0.813: D4.A D3.A 46.99,38.1 C12.- | JP3.2 61.92,39.68 C13.- | D5.A 62.23,25.4 64.77,27.94 64.77,36.83 C13.- | D4.A 58.42,33.02 C13.- | R11.1 54.61,35.56 D4.A
N$29  (3 unrouted)
  Bottom 0.61: U$6.CSN 83.19,40.13 80.26,40.13 78.23,38.1 74.93,38.1 73.91,39.12 73.91,40.64 73.41,41.15 73.41,48.26 77.47,48.26 | R12.2 R13.2 | R17.2 R16.2 | R14.2 R15.2 | R19.2 R18.2 93.22,48.26 87.88,48.26 | 87.88,48.26 82.8,48.26 | 82.8,48.26 77.47,48.26 | 82.8,48.26 R16.2 | 87.88,48.26 87.88,46.74 88.14,46.48 | 77.47,48.26 77.47,46.48
  Bottom 1.016: R19.2 94.74,43.69 97.54,40.89 97.54,32 JP5.1
N$30
  Bottom 0.813: IC3.4 54.61,47.6 | 54.61,47.6 56.54,47.6 JP3.1 C13.+ | R10.2 54.61,47.6
N$31
  Top 0.406: D8.A 94,4.43 R26.1
N$33
  Bottom 0.406: T1.3 83.57,5.59 82.55,4.57 82.55,3.16 R25.1
  Bottom 0.61: R25.1 82.67,1.64 82.04,1.02 76.71,1.02 75.69,2.03 Q2.G
N$35
  Bottom 0.406: D7.C 86.61,31.75 87.88,30.48 R20.1
  Bottom 0.61: D7.C 84.07,32.77 83.31,33.53 U$6.DIM
N$36
  Bottom 0.406: C20.2 R27.2
N$37
  Bottom 0.61: U$6.SW 87.5,36.2 88.65,35.05 D6.A
  Bottom 1.016: L1.2 90.84,34.71 D6.A
N$38
  Bottom 1.016: L1.1 95.84,35.65 93.98,33.78 93.98,30.73 95,29.72 95,28.96 95.5,28.45 JP5.2
N$42
  Top 1.016: Q2.D 78.23,5.59 78.99,6.35 85.34,6.35 86.11,5.59 86.11,3.43 JP9.2
  Bottom 0.406: Q2.D 78.23,5.46 C20.1
N$43  (via drill 0.6)
  Top 0.305: v92.96,21.84 93.98,22.86 93.98,26.42 92.2,28.19 C18.1
  Bottom 0.305: U$9.8 92.56,21.44 v92.96,21.84
N$44
  Bottom 0.406: T1.1 82.62,8.96 83.31,9.65 R23.2
NRST
  Bottom 0.305: JP11.4 85.99,24.13 R24.1
  Bottom 0.406: U$9.4 89.96,21.34 | 89.96,21.34 89.96,21.8 JP11.4 | C19.1 89.96,21.34
PWM1
  Bottom 0.406: U$9.20 88.01,9.67 R23.1
PWM2
  Bottom 0.406: U$9.10 94.81,19.12 97.03,21.34 97.03,25.91 96.52,26.42 95.5,26.42 92.96,28.96 92.96,30.23 92.71,30.48 R20.2
SW_A
  Bottom 0.406: U$10.1 96.74,10.89 96.01,10.16 92.96,10.16 92.56,10.57 U$9.13
SW_B
  Bottom 0.406: U$10.3 84.93,11.53 88.39,14.99 90.42,14.99 91.26,14.15 U$9.15
SW_P
  Bottom 0.406: U$9.14 91.91,9.16 U$10.2
SWIM  (via drill 0.6)
  Top 0.406: v89.92,13.97 91.69,15.75 91.69,16.76 91.95,17.02 91.95,23.37 JP11.2
  Bottom 0.406: U$9.18 89.31,13.36 v89.92,13.97
VIN
  Top 1.016: JP9.1 89.03,5.21 86.11,8.13 78.99,8.13 73.66,12.7 73.66,27.94 | C14.1 76.18,35.29 73.66,33.02 73.66,27.94 | JP4.2 73.79,28.07 73.66,27.94
  Bottom 0.61: R25.2 84.47,1.64 85.09,1.02 86.74,1.02 JP9.1 | R13.1 R12.1 74.8,41.79 C14.1 77.69,41.91 80.01,41.91 | R16.1 R17.1 80.01,41.91 | R15.1 R14.1 85.21,42.04 85.34,41.91 | R18.1 R19.1 90.42,41.91 86.36,41.91 | 80.01,41.91 85.34,41.91 | 85.34,41.91 86.36,41.91 | D6.C 88.52,40.01 U$6.VIN 86.36,41.91
  Bottom 0.813: U1.3 78.74,30.23 77.98,29.46 77.72,29.46 JP4.2
VREG
  Top 1.016: C16.1 94.23,21.08 95.12,21.97 95.12,24 JP11.1
  Bottom 0.305: R24.2 85.34,27.56 U1.TER
  Bottom 0.406: 82.67,25.03 82.55,25.15 | U$9.9 93.21,20.05 95.25,22.1 JP11.1
  Bottom 0.61: JP11.1 95.25,25.15 94.23,26.16 88.9,26.16 87.12,27.94 U1.TER
  Bottom 1.016: U1.2 82.55,27.94 | 82.55,27.94 U1.TER | C17.1 80.62,22.96 82.55,24.89 82.55,25.15 82.55,27.94
VSUP
  Bottom 1.016: 8.32,34.29 10.16,34.29 13.34,37.47 13.34,38.73 13.97,39.37 16.51,39.37 17.78,40.64 17.78,42.55 18.61,43.38 C10.1 22.67,40.89 25.91,40.89 26.83,41.81 JP1.1 | 7.62,34.29 8.32,34.29 | 8.32,34.29 IC2.3